# Altium schematic sheet chip.SchDoc
size C
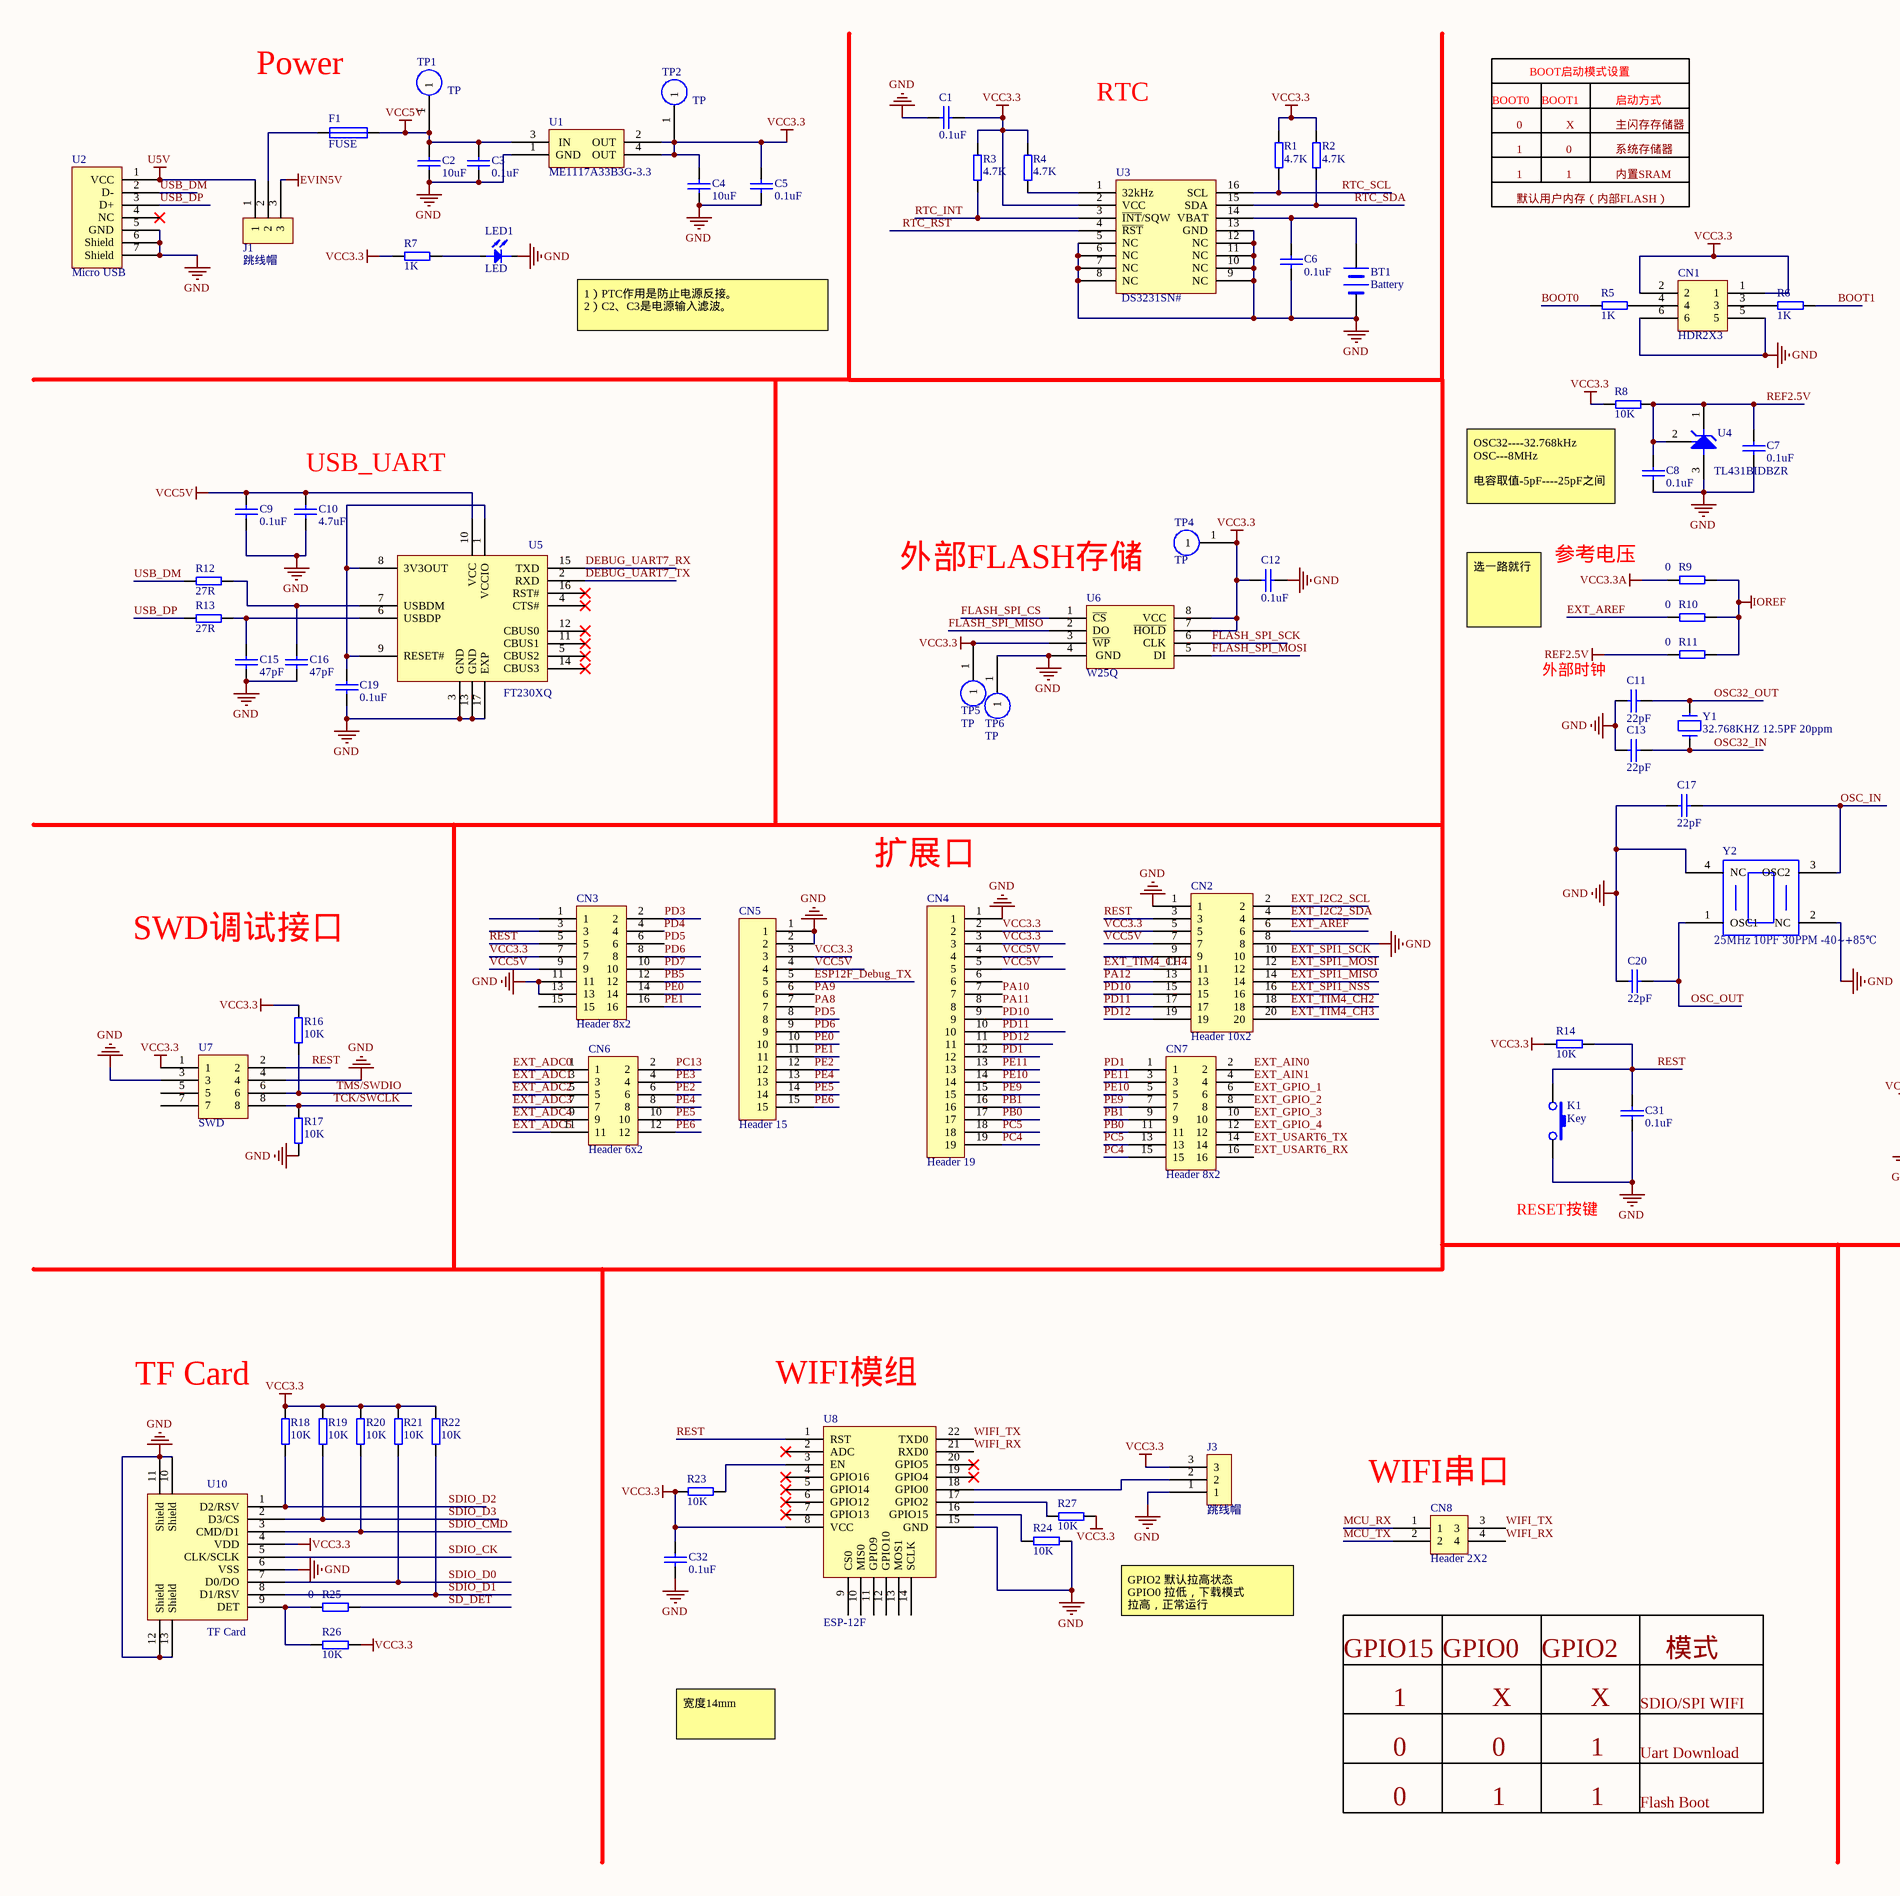
[diagram p0: chip.SchDoc, left]
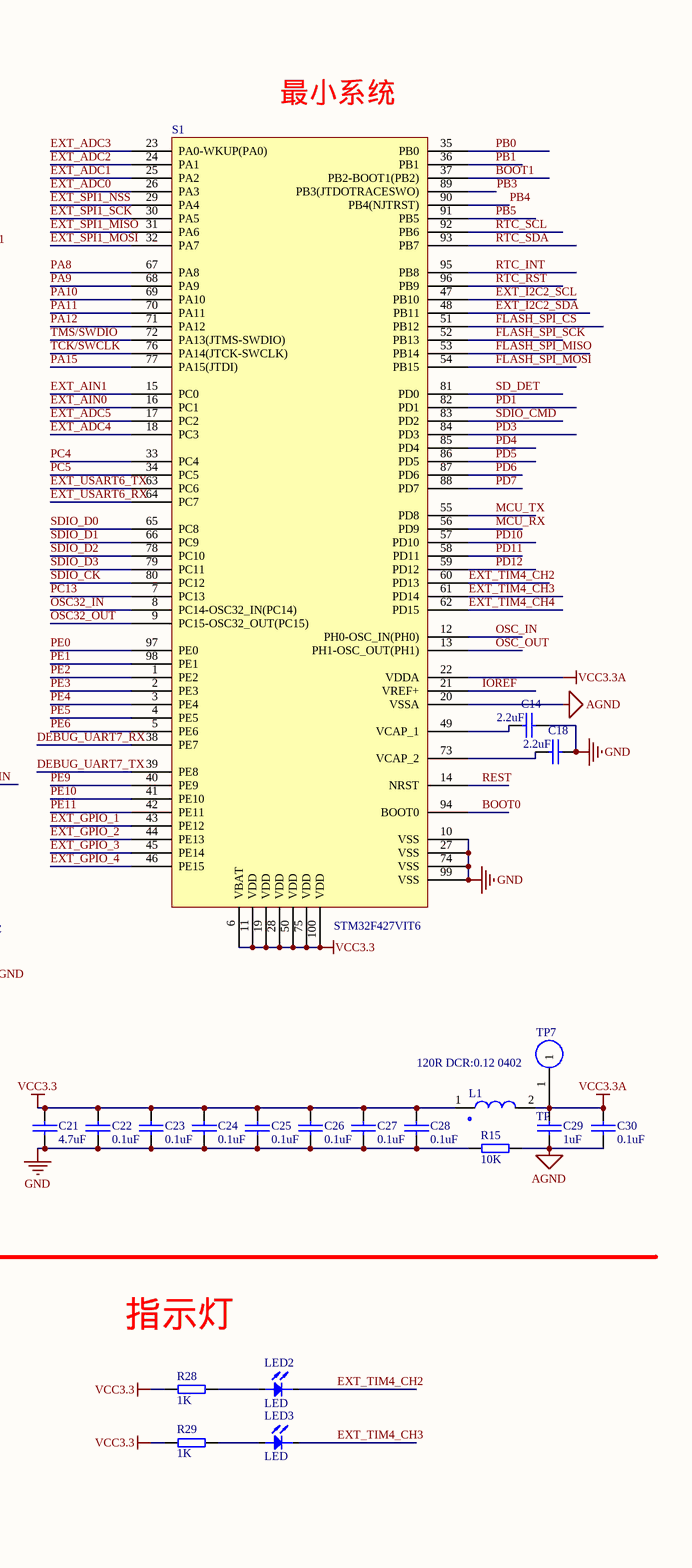
[diagram p1: chip.SchDoc, right]

## Parts
BT1  Battery  [CR1220-2]
C1  0.1uF  [0603 - CAP]
C2  10uF  [0603 - CAP]
C3  0.1uF  [0603 - CAP]
C4  10uF  [0603 - CAP]
C5  0.1uF  [0603 - CAP]
C6  0.1uF  [0603 - CAP]
C7  0.1uF  [0603 - CAP]
C8  0.1uF  [0603 - CAP]
C9  0.1uF  [0603 - CAP]
C10  4.7uF  [0603 - CAP]
C11  22pF  [0603 - CAP]
C12  0.1uF  [0603 - CAP]
C13  22pF  [0603 - CAP]
C14  2.2uF  [0603 - CAP]
C15  47pF  [0603 - CAP]
C16  47pF  [0603 - CAP]
C17  22pF  [0603 - CAP]
C18  2.2uF  [0603 - CAP]
C19  0.1uF  [0603 - CAP]
C20  22pF  [0603 - CAP]
C21  4.7uF  [0603 - CAP]
C22  0.1uF  [0603 - CAP]
C23  0.1uF  [0603 - CAP]
C24  0.1uF  [0603 - CAP]
C25  0.1uF  [0603 - CAP]
C26  0.1uF  [0603 - CAP]
C27  0.1uF  [0603 - CAP]
C28  0.1uF  [0603 - CAP]
C29  1uF  [0603 - CAP]
C30  0.1uF  [0603 - CAP]
C31  0.1uF  [0603 - CAP]
C32  0.1uF  [0603 - CAP]
CN1  HDR2X3  [HDR2X3 - duplicate1]
CN2  Header 10x2  [HDR2X10]
CN3  Header 8x2  [HDR2X8]
CN4  Header 19  [HDR1X19 - duplicate]
CN5  Header 15  [HDR1X15]
CN6  Header 6x2  [HDR2X6]
CN7  Header 8x2  [HDR2X8]
CN8  Header 2X2  [HDR2X2 - duplicate]
F1  FUSE  [PTC]
J1  跳线帽  [HDR1X3 - duplicate1]
J3  跳线帽  [HDR1X3 - duplicate1]
K1  Key  [Key 3*6*3.5侧按]
L1  120R DCR:0.12 0402  [120R DCR=0.12 0402]
LED1  LED  [0603-LED]
LED2  LED  [0603-LED]
LED3  LED  [0603-LED]
R1  4.7K  [0603 - RES]
R2  4.7K  [0603 - RES]
R3  4.7K  [0603 - RES]
R4  4.7K  [0603 - RES]
R5  1K  [0603 - RES]
R6  1K  [0603 - RES]
R7  1K  [0603 - RES]
R8  10K  [0603 - RES]
R9  0  [0603 - RES]
R10  0  [0603 - RES]
R11  0  [0603 - RES]
R12  27R  [0603 - RES]
R13  27R  [0603 - RES]
R14  10K  [0603 - RES]
R15  10K  [0603 - RES]
R16  10K  [0603 - RES]
R17  10K  [0603 - RES]
R18  10K  [0603 - RES]
R19  10K  [0603 - RES]
R20  10K  [0603 - RES]
R21  10K  [0603 - RES]
R22  10K  [0603 - RES]
R23  10K  [0603 - RES]
R24  10K  [0603 - RES]
R25  0  [0603 - RES]
R26  10K  [0603 - RES]
R27  10K  [0603 - RES]
R28  1K  [0603 - RES]
R29  1K  [0603 - RES]
S1  STM32F427VIT6  [LQFP100_M]
TP1  TP  [Test-1]
TP2  TP  [Test-1]
TP4  TP  [Test-1]
TP5  TP  [Test-1]
TP6  TP  [Test-1]
TP7  TP  [Test-1]
U1  ME1117A33B3G-3.3  [ME1117A33B3G]
U2  Micro USB  [USB-C46389]
U3  DS3231SN#  [SOIC-16_300mil]
U4  TL431BIDBZR  [SOT-23-3]
U5  FT230XQ  [QFN-16_4x4x065p]
U6  W25Q  [SOIC-8_208mil]
U7  SWD  [SWD-8p]
U8  ESP-12F  [ESP-12 slice]
U10  TF Card  [TF-015]
Y1  32.768KHZ 12.5PF 20ppm  [SMD-3215-2p]
Y2  value 25MHz 10PF 30PPM -40~+85℃  [SMD-3225 4p]  (hidden comment: SMD_3225)

## Nets
AGND: C29.1 C30.1 R15.2 S1.20(VSSA)
EVIN5V: J1.3
GND: BT1.2(-) C1.1 C2.2 C3.2 C4.2 C5.2 C6.1 C7.1 C8.1 C9.2 C10.1 C11.1 C12.1 C13.1 C14.2 C15.2 C16.2 C17.1 C18.2 C19.2 C20.1 C21.1 C22.1 C23.1 C24.1 C25.1 C26.1 C27.1 C28.1 C31.1 C32.2 CN1.5 CN1.6 CN2.1 CN2.8 CN3.11 CN3.13 CN4.1 CN5.1 CN5.2 J3.1 K1.D LED1.2 R15.1 R17.1 R24.2 S1.10(VSS) S1.27(VSS) S1.74(VSS) S1.99(VSS) TP6.1 U1.1(GND) U2.5(GND) U2.6(Shield) U2.7(Shield) U3.5(NC) U3.6(NC) U3.7(NC) U3.8(NC) U3.9(NC) U3.10(NC) U3.11(NC) U3.12(NC) U3.13(GND) U4.3(CHATHODAN) U5.3(GND) U5.13(GND) U5.17(EXP) U6.4(GND) U7.3 U7.4 U8.15(GND) U10.6(VSS) U10.10(Shield) U10.11(Shield) U10.12(Shield) U10.13(Shield) Y2.2(NC) Y2.4(NC)
IOREF: R9.2 R10.2 R11.2 S1.21(VREF+)
REF2.5V: C7.2 C8.2 R8.2 R11.1 U4.1(ENODE) U4.2(REF)
U5V: J1.1 U2.1(VCC)
VCC3.3: C1.2 C4.1 C5.1 C12.2 C21.2 C22.2 C23.2 C24.2 C25.2 C26.2 C27.2 C28.2 C32.1 CN1.1 CN1.2 CN2.5 CN3.7 CN4.2 CN4.3 CN5.3 J3.3 L1.1 R1.2 R2.2 R3.2 R4.2 R7.1 R8.1 R14.1 R16.2 R18.2 R19.2 R20.2 R21.2 R22.2 R23.1 R26.2 R27.2 R28.1 R29.1 S1.6(VBAT) S1.11(VDD) S1.19(VDD) S1.28(VDD) S1.50(VDD) S1.75(VDD) S1.100(VDD) TP2.1 TP4.1 TP5.1 U1.2(OUT) U1.4(OUT) U3.2(VCC) U6.3(~{WP}) U6.7(~{HOLD}) U6.8(VCC) U7.1 U8.8(VCC) U10.4(VDD)
VCC3.3A: C29.2 C30.2 L1.2 R9.1 S1.22(VDDA) TP7.1
VCC5V: C2.1 C3.1 C9.1 C10.2 CN2.7 CN3.9 CN4.4 CN4.5 CN5.4 F1.2 TP1.1 U1.3(IN) U5.10(VCC)
BOOT0: R5.1 S1.94(BOOT0)
BOOT1: R6.2 S1.37(PB2-BOOT1(PB2))
DEBUG_UART7_RX: S1.38(PE7) U5.15(TXD)
DEBUG_UART7_TX: S1.39(PE8) U5.2(RXD)
ESP12F_Debug_TX: CN5.5
EXT_ADC0: CN6.1 S1.26(PA3)
EXT_ADC1: CN6.3 S1.25(PA2)
EXT_ADC2: CN6.5 S1.24(PA1)
EXT_ADC3: CN6.7 S1.23(PA0-WKUP(PA0))
EXT_ADC4: CN6.9 S1.18(PC3)
EXT_ADC5: CN6.11 S1.17(PC2)
EXT_AIN0: CN7.2 S1.16(PC1)
EXT_AIN1: CN7.4 S1.15(PC0)
EXT_AREF: CN2.6 R10.1
EXT_GPIO_1: CN7.6 S1.43(PE12)
EXT_GPIO_2: CN7.8 S1.44(PE13)
EXT_GPIO_3: CN7.10 S1.45(PE14)
EXT_GPIO_4: CN7.12 S1.46(PE15)
EXT_I2C2_SCL: CN2.2 S1.47(PB10)
EXT_I2C2_SDA: CN2.4 S1.48(PB11)
EXT_SPI1_MISO: CN2.14 S1.31(PA6)
EXT_SPI1_MOSI: CN2.12 S1.32(PA7)
EXT_SPI1_NSS: CN2.16 S1.29(PA4)
EXT_SPI1_SCK: CN2.10 S1.30(PA5)
EXT_TIM4_CH2: CN2.18 LED2.2 S1.60(PD13)
EXT_TIM4_CH3: CN2.20 LED3.2 S1.61(PD14)
EXT_TIM4_CH4: CN2.11 S1.62(PD15)
EXT_USART6_RX: CN7.16 S1.64(PC7)
EXT_USART6_TX: CN7.14 S1.63(PC6)
FLASH_SPI_CS: S1.51(PB12) U6.1(~{CS})
FLASH_SPI_MISO: S1.53(PB14) U6.2(DO)
FLASH_SPI_MOSI: S1.54(PB15) U6.5(DI)
FLASH_SPI_SCK: S1.52(PB13) U6.6(CLK)
MCU_RX: CN8.1 S1.56(PD9)
MCU_TX: CN8.2 S1.55(PD8)
OSC32_IN: C13.2 S1.8(PC14-OSC32_IN(PC14)) Y1.1
OSC32_OUT: C11.2 S1.9(PC15-OSC32_OUT(PC15)) Y1.2
OSC_IN: C17.2 S1.12(PH0-OSC_IN(PH0)) Y2.3(OSC2)
OSC_OUT: C20.2 S1.13(PH1-OSC_OUT(PH1)) Y2.1(OSC1)
PA8: CN5.7 S1.67(PA8)
PA9: CN5.6 S1.68(PA9)
PA10: CN4.7 S1.69(PA10)
PA11: CN4.8 S1.70(PA11)
PA12: CN2.13 S1.71(PA12)
PA15: S1.77(PA15(JTDI))
PB0: CN4.17 CN7.11 S1.35(PB0)
PB1: CN4.16 CN7.9 S1.36(PB1)
PB3: S1.89(PB3(JTDOTRACESWO))
PB4: S1.90(PB4(NJTRST))
PB5: CN3.12 S1.91(PB5)
PC4: CN4.19 CN7.15 S1.33(PC4)
PC5: CN4.18 CN7.13 S1.34(PC5)
PC13: CN6.2 S1.7(PC13)
PD1: CN4.12 CN7.1 S1.82(PD1)
PD3: CN3.2 S1.84(PD3)
PD4: CN3.4 S1.85(PD4)
PD5: CN3.6 CN5.8 S1.86(PD5)
PD6: CN3.8 CN5.9 S1.87(PD6)
PD7: CN3.10 S1.88(PD7)
PD10: CN2.15 CN4.9 S1.57(PD10)
PD11: CN2.17 CN4.10 S1.58(PD11)
PD12: CN2.19 CN4.11 S1.59(PD12)
PE0: CN3.14 CN5.10 S1.97(PE0)
PE1: CN3.16 CN5.11 S1.98(PE1)
PE2: CN5.12 CN6.6 S1.1(PE2)
PE3: CN6.4 S1.2(PE3)
PE4: CN5.13 CN6.8 S1.3(PE4)
PE5: CN5.14 CN6.10 S1.4(PE5)
PE6: CN5.15 CN6.12 S1.5(PE6)
PE9: CN4.15 CN7.7 S1.40(PE9)
PE10: CN4.14 CN7.5 S1.41(PE10)
PE11: CN4.13 CN7.3 S1.42(PE11)
REST: C31.2 CN2.3 CN3.5 K1.C R14.2 S1.14(NRST) U7.2 U8.1(RST)
RTC_INT: R3.1 S1.95(PB8) U3.3(~{INT}/SQW)
RTC_RST: S1.96(PB9) U3.4(~{RST})
RTC_SCL: R1.1 S1.92(PB6) U3.16(SCL)
RTC_SDA: R2.1 S1.93(PB7) U3.15(SDA)
SD_DET: R25.2 S1.81(PD0)
SDIO_CK: S1.80(PC12) U10.5(CLK/SCLK)
SDIO_CMD: R20.1 S1.83(PD2) U10.3(CMD/D1)
SDIO_D0: R21.1 S1.65(PC8) U10.7(D0/DO)
SDIO_D1: R22.1 S1.66(PC9) U10.8(D1/RSV)
SDIO_D2: R18.1 S1.78(PC10) U10.1(D2/RSV)
SDIO_D3: R19.1 S1.79(PC11) U10.2(D3/CS)
TCK/SWCLK: R17.2 S1.76(PA14(JTCK-SWCLK)) U7.8
TMS/SWDIO: R16.1 S1.72(PA13(JTMS-SWDIO)) U7.6
USB_DM: R12.1 U2.2(D-)
USB_DP: R13.1 U2.3(D+)
WIFI_RX: CN8.4 U8.21(RXD0)
WIFI_TX: CN8.3 U8.22(TXD0)
NetBT1_1: BT1.1(+) C6.2 U3.14(VBAT)
NetC14_1: C14.1 S1.49(VCAP_1)
NetC15_1: C15.1 R13.2 U5.6(USBDP)
NetC16_1: C16.1 R12.2 U5.7(USBDM)
NetC18_1: C18.1 S1.73(VCAP_2)
NetC19_1: C19.1 U5.1(VCCIO) U5.8(3V3OUT) U5.9(RESET#)
NetCN1_3: CN1.3 R6.1
NetCN1_4: CN1.4 R5.2
NetF1_1: F1.1 J1.2
NetJ3_2: J3.2 U8.18(GPIO0)
NetLED1_1: LED1.1 R7.2
NetLED2_1: LED2.1 R28.2
NetLED3_1: LED3.1 R29.2
NetR4_1: R4.1 U3.1(32kHz)
NetR23_2: R23.2 U8.3(EN)
NetR24_1: R24.1 U8.16(GPIO15)
NetR25_1: R25.1 R26.1 U10.9(DET)
NetR27_1: R27.1 U8.17(GPIO2)

Not connected (* = marked no-connect by the designer): CN2 9; CN3 1 3 15; CN4 6; U2 4(NC)*; U5 4(CTS#)* 5(CBUS2)* 11(CBUS1)* 12(CBUS0)* 14(CBUS3)* 16(RST#)*; U7 5 7; U8 2(ADC)* 4(GPIO16)* 5(GPIO14)* 6(GPIO12)* 7(GPIO13)* 9(CS0) 10(MIS0) 11(GPIO9) 12(GPIO10) 13(MOS1) 14(SCLK) 19(GPIO4)* 20(GPIO5)*

## Notes on the sheet
- (near F1) Power
- BOOT启动模式设置
- RTC
- BOOT0
- 1
- 0
- BOOT1
- X
- 启动方式
- 系统存储器
- 主闪存存储器
- 默认用户内存（内部FLASH）
- 内置SRAM
- (near S1) 最小系统
- 1）PTC作用是防止电源反接。
  2）C2、C3是电源输入滤波。
- (near C10) USB_UART
- OSC32----32.768kHz
  OSC---8MHz
  电容取值-5pF----25pF之间
- 外部FLASH存储
- 参考电压
- 选一路就行
- 外部时钟
- 扩展口
- SWD调试接口
- RESET按键
- (near R28) 指示灯
- (near R18) TF Card
- (near U8) WIFI模组
- (near CN8) WIFI串口
- GPIO2 默认拉高状态
  GPIO0 拉低，下载模式
  拉高，正常运行
- GPIO15
- GPIO0
- GPIO2
- 模式
- SDIO/SPI WIFI
- 宽度14mm
- Uart Download
- Flash Boot

## Library data of the parts
BT1 = Battery: Manufactor: Q&J; Value: CR1220-2 电池卧式底座; Package: CR1220
C1 C3 C5-C9 C12 C19 C22-C28 C30-C32 = Capacity_normal: MAnufactor: YAGEO(国巨); Value: 100nF(104) ±10% 10V; Package: 0603
C2 C4 = Capacity_normal: MAnufactor: YAGEO(国巨); Value: 10uF(106) ±10% 10V; Package: 0603
C10 C21 = Capacity_normal: MAnufactor: muRata(村田); Value: 4.7uF ±10% 6.3V; Package: 0603
C11 C13 C17 C20 = Capacity_normal: MAnufactor: Knowles(楼氏); Value: 22pF ±1% 10V; Package: 0603
C14 C18 = Capacity_normal: MAnufactor: SAMSUNG(三星); Value: 2.2uF(225) ±10% 10V; Package: 0603
C15 C16 = Capacity_normal: MAnufactor: KEMET(基美); Value: 47pF ±1% 10V; Package: 0603
C29 = Capacity_normal: MAnufactor: YAGEO(国巨); Value: 1uF(105) ±10% 6.3V; Package: 0603
CN1 = HDR2X3: Manufactor: CJT(长江连接器); Value: 杜邦2.0排针直插 镀金 6P 双排 针座连接器; Package: Through Hole,P=2mm
CN2 = Header 10x2: 10x2 双排，2.54mm间距
CN3 CN7 = Header 8x2: 8x2双排，2.54mm间距
CN4 = Header 19: 19 单排，2.54mm间距
CN5 = Header 15: 15 单排，2.54mm间距
CN6 = Header 6x2: 6x2 双排，2.54mm间距
CN8 = Header 2X2: Value: 排针 2X2 2.54; Manufactor: *
F1 = FUSE: Manufactor: 良胜; Value: 1A/32V; Package: SMD0603
J1 J3 = Header 3: Header,3-pin; Manufactor: *; Package: 2mm 1X3排针
K1 = Key: Manufactor: SHOU HAN(首韩); Value: 轻触开关 3*6*3.5侧按 直径0.6定位柱 白体黑头 250力度; Package: SMD
L1 = 电感 120: Manufactor: RESI(开步睿思）; Value: 120Ω(120R) ±1%; Package: 0603
LED1-LED3 = LED: Manufactor: 台湾亿光; Package: 0603; Value: *
R1-R4 = RES: Manufactor: YAGEO(国巨); Value: 4.7KΩ(472) ±5%; Package: 0603
R5-R7 R28 R29 = RES: Manufactor: YAGEO(国巨); Value: 1KΩ(1K) ±1% 50PPM; Package: 0603
R8 R14-R24 R26 R27 = RES: Manufactor: UNI-ROYAL(厚声); Value: 10KΩ ±1%; Package: 0603
R9-R11 R25 = RES: Manufactor: YAGEO(国巨); Value: 0Ω(0000) ±1%; Package: 0603
R12 R13 = RES: Manufactor: UNI-ROYAL(厚声); Value: 27Ω ±1%; Package: 0603
S1 = STM32F427VIT6: Manufactor: ST; Package: LQFP100
TP1 TP2 TP4-TP7 = TP: Test Point
U1 = ME1117A33B3G-3.3: Manufactor: MICRONE(南京微盟); Value: AMS1117-3.3; Package: SOT-223
U2 = Micro USB: Manufactor: 精拓金; Value: C46389; Package: SMD
U3 = DS3231SN#: 实时时钟芯片，SOIC_16; Manufactor: MAXIM(美信); Value: DS3231SN#T&R; Package: SOIC-16_300mil
U4 = TL431BIDBZR: Manufactor: TI(德州仪器); Package: SOT-23(SOT-23-3); Value: TL431BIDBZR
U5 = FT230XQ: USB转串口 ，QFN-16; Manufactor: FTDI(飞特帝亚); Value: FT230XQ-R; Package: QFN-16_4x4x065P
U6 = W25Q: W25Q，WSON-8; Manufactor: WINBOND(华邦); Value: W25Q80DVSSIG; Package: SOIC-8_208mil
U7 = SWD: SWD接口; Manufactor: CJT(长江连接器); Value: 8P,脚距2.54mm; Package: Through Hole,P=2.54mm
U8 = ESP-12F: Manufactor: Ai-Thinker(安信可); Value: ESP-12F(ESP8266MOD); Package: WIFI Module
U10 = TF Card: TF card,TF-15x15; Manufactor: SOFNG(硕方); Value: TF-015; Package: *
Y1 = SMD-3215: Manufactor: TAITIEN(泰艺电子); Package: SMD-3215-2P; Value: 32.768KHZ 12.5PF 20ppm
Y2 = SMD_3225: Manufactor: TAITIEN(泰艺电子); Package: SMD-3225_4P